# Altium schematic sheet SCH_PLC_Khanh.SchDoc
size A; SheetNumber: 1; SheetTotal: 9
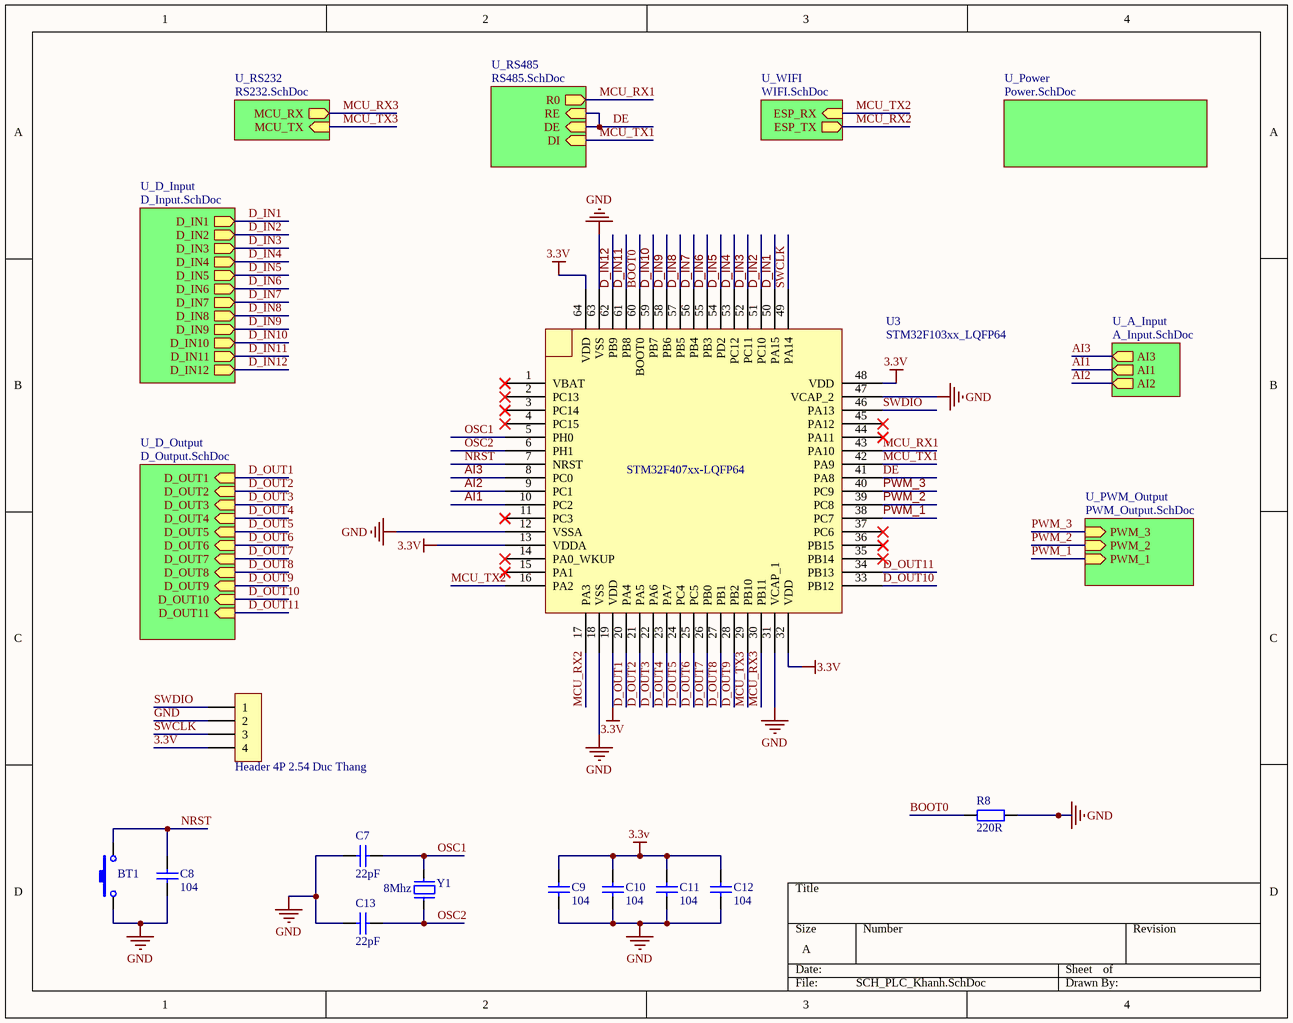
[diagram p0: SCH_PLC_Khanh.SchDoc]

## Parts
BT1  Nut Nhan 2 Chan SMD 3x6x2.5  [Nut Nhan 2 Chan SMD 3x6x2.5]  (value not drawn)
C7  22pF  [tu 0805]
C8  104  [tu 0805]
C9  104  [tu 0805]
C10  104  [tu 0805]
C11  104  [tu 0805]
C12  104  [tu 0805]
C13  22pF  [tu 0805]
H1  Header 4P 2.54 Duc Thang  [XH2.54M-4]
R8  220R  [tro smd 0805]
U3  STM32F103xx_LQFP64  [STM32_LQFP64]
Y1  8Mhz  [Thach Anh 2 chan SMD]

## Sub-sheets
U_A_Input = A_Input.SchDoc: AI3 (out), AI1 (out), AI2 (out)
U_D_Input = D_Input.SchDoc: D_IN12 (out), D_IN7 (out), D_IN4 (out), D_IN2 (out), D_IN9 (out), D_IN8 (out), D_IN11 (out), D_IN3 (out), D_IN5 (out), D_IN1 (out), D_IN10 (out), D_IN6 (out)
U_D_Output = D_Output.SchDoc: D_OUT9 (in), D_OUT8 (in), D_OUT4 (in), D_OUT7 (in), D_OUT5 (in), D_OUT2 (in), D_OUT11 (in), D_OUT10 (in), D_OUT6 (in), D_OUT1 (in), D_OUT3 (in)
U_Power = Power.SchDoc: no entries
U_PWM_Output = PWM_Output.SchDoc: PWM_3 (in), PWM_2 (in), PWM_1 (in)
U_RS232 = RS232.SchDoc: MCU_RX (out), MCU_TX (in)
U_RS485 = RS485.SchDoc: R0 (out), RE (in), DE (in), DI (in)
U_WIFI = WIFI.SchDoc: ESP_TX (out), ESP_RX (in)

## Nets
3.3V: C9.2 C10.2 C11.1 C12.2 H1.4 U3.13(VDDA) U3.19(VDD) U3.32(VDD) U3.48(VDD) U3.64(VDD)
GND: BT1.1 C7.1 C8.2 C9.1 C10.1 C11.2 C12.1 C13.1 H1.2 R8.2 U3.12(VSSA) U3.18(VSS) U3.31(VCAP_1) U3.47(VCAP_2) U3.63(VSS)
AI1: U3.10(PC2) ; sheet U_A_Input/AI1
AI2: U3.9(PC1) ; sheet U_A_Input/AI2
AI3: U3.8(PC0) ; sheet U_A_Input/AI3
BOOT0: R8.1 U3.60(BOOT0)
D_IN1: U3.50(PA15) ; sheet U_D_Input/D_IN1
D_IN2: U3.51(PC10) ; sheet U_D_Input/D_IN2
D_IN3: U3.52(PC11) ; sheet U_D_Input/D_IN3
D_IN4: U3.53(PC12) ; sheet U_D_Input/D_IN4
D_IN5: U3.54(PD2) ; sheet U_D_Input/D_IN5
D_IN6: U3.55(PB3) ; sheet U_D_Input/D_IN6
D_IN7: U3.56(PB4) ; sheet U_D_Input/D_IN7
D_IN8: U3.57(PB5) ; sheet U_D_Input/D_IN8
D_IN9: U3.58(PB6) ; sheet U_D_Input/D_IN9
D_IN10: U3.59(PB7) ; sheet U_D_Input/D_IN10
D_IN11: U3.61(PB8) ; sheet U_D_Input/D_IN11
D_IN12: U3.62(PB9) ; sheet U_D_Input/D_IN12
D_OUT1: U3.20(PA4) ; sheet U_D_Output/D_OUT1
D_OUT2: U3.21(PA5) ; sheet U_D_Output/D_OUT2
D_OUT3: U3.22(PA6) ; sheet U_D_Output/D_OUT3
D_OUT4: U3.23(PA7) ; sheet U_D_Output/D_OUT4
D_OUT5: U3.24(PC4) ; sheet U_D_Output/D_OUT5
D_OUT6: U3.25(PC5) ; sheet U_D_Output/D_OUT6
D_OUT7: U3.26(PB0) ; sheet U_D_Output/D_OUT7
D_OUT8: U3.27(PB1) ; sheet U_D_Output/D_OUT8
D_OUT9: U3.28(PB2) ; sheet U_D_Output/D_OUT9
D_OUT10: U3.33(PB12) ; sheet U_D_Output/D_OUT10
D_OUT11: U3.34(PB13) ; sheet U_D_Output/D_OUT11
DE: U3.41(PA8) ; sheet U_RS485/RE, sheet U_RS485/DE
MCU_RX1: U3.43(PA10) ; sheet U_RS485/R0
MCU_RX2: U3.17(PA3) ; sheet U_WIFI/ESP_TX
MCU_RX3: U3.30(PB11) ; sheet U_RS232/MCU_RX
MCU_TX1: U3.42(PA9) ; sheet U_RS485/DI
MCU_TX2: U3.16(PA2) ; sheet U_WIFI/ESP_RX
MCU_TX3: U3.29(PB10) ; sheet U_RS232/MCU_TX
NRST: BT1.2 C8.1 U3.7(NRST)
OSC1: C7.2 U3.5(PH0) Y1.2
OSC2: C13.2 U3.6(PH1) Y1.1
PWM_1: U3.38(PC7) ; sheet U_PWM_Output/PWM_1
PWM_2: U3.39(PC8) ; sheet U_PWM_Output/PWM_2
PWM_3: U3.40(PC9) ; sheet U_PWM_Output/PWM_3
SWCLK: H1.3 U3.49(PA14)
SWDIO: H1.1 U3.46(PA13)

Not connected (* = marked no-connect by the designer): U3 1(VBAT)* 2(PC13)* 3(PC14)* 4(PC15)* 11(PC3)* 14(PA0_WKUP)* 15(PA1)* 35(PB14)* 36(PB15)* 37(PC6)* 44(PA11)* 45(PA12)*

## Notes on the sheet
- (in symbol STM32F103xx_LQFP64) STM32F407xx-LQFP64

## Library data of the parts
BT1 = Nut Nhan 2 Chan SMD 3x6x2.5: Ma_Hang: MH001036; Ten: Nút Nhấn 2 Chân 3x6x2.5MM SMD
C7 C13 = Tu 0805 22pF 50V 10%: Dán; Don_Vi: Con; So_Chan: 2; Ten_Linh_Kien: Tụ 0805 22P 10% 50V; Ma_Hang: MH004560; Chung_Loai: Dán; Kieu_Chan: *
C8-C12 = Tu 0805 104 50V 10%: Dán; Don_Vi: Con; So_Chan: 2; Ten_Linh_Kien: Tụ 0805 104-100nF 10% 50V; Ma_Hang: MH004551; Chung_Loai: Dán; Kieu_Chan: *
H1 = Header 4P 2.54 Duc Thang: Cắm; Ten_Linh_Kien: Header 4P XH2.54-4P Đực Thẳng; Don_Vi: Con; Ma_Hang: MH001285; Chung_Loai: Cắm
R8 = Tro 0805 5% 220R: Dán; Don_Vi: Con; So_Chan: 2; Ten_Linh_Kien: Trở 0805 5% 220R; Ma_Hang: MH005259; Chung_Loai: Dán; Kieu_Chan: *
Y1 = Thach Anh 2 chan SMD: Crystal For all Crystal 2pin.; Value: 4Mhz